# EAGLE schematic handshake (EAGLE 7.6.0)
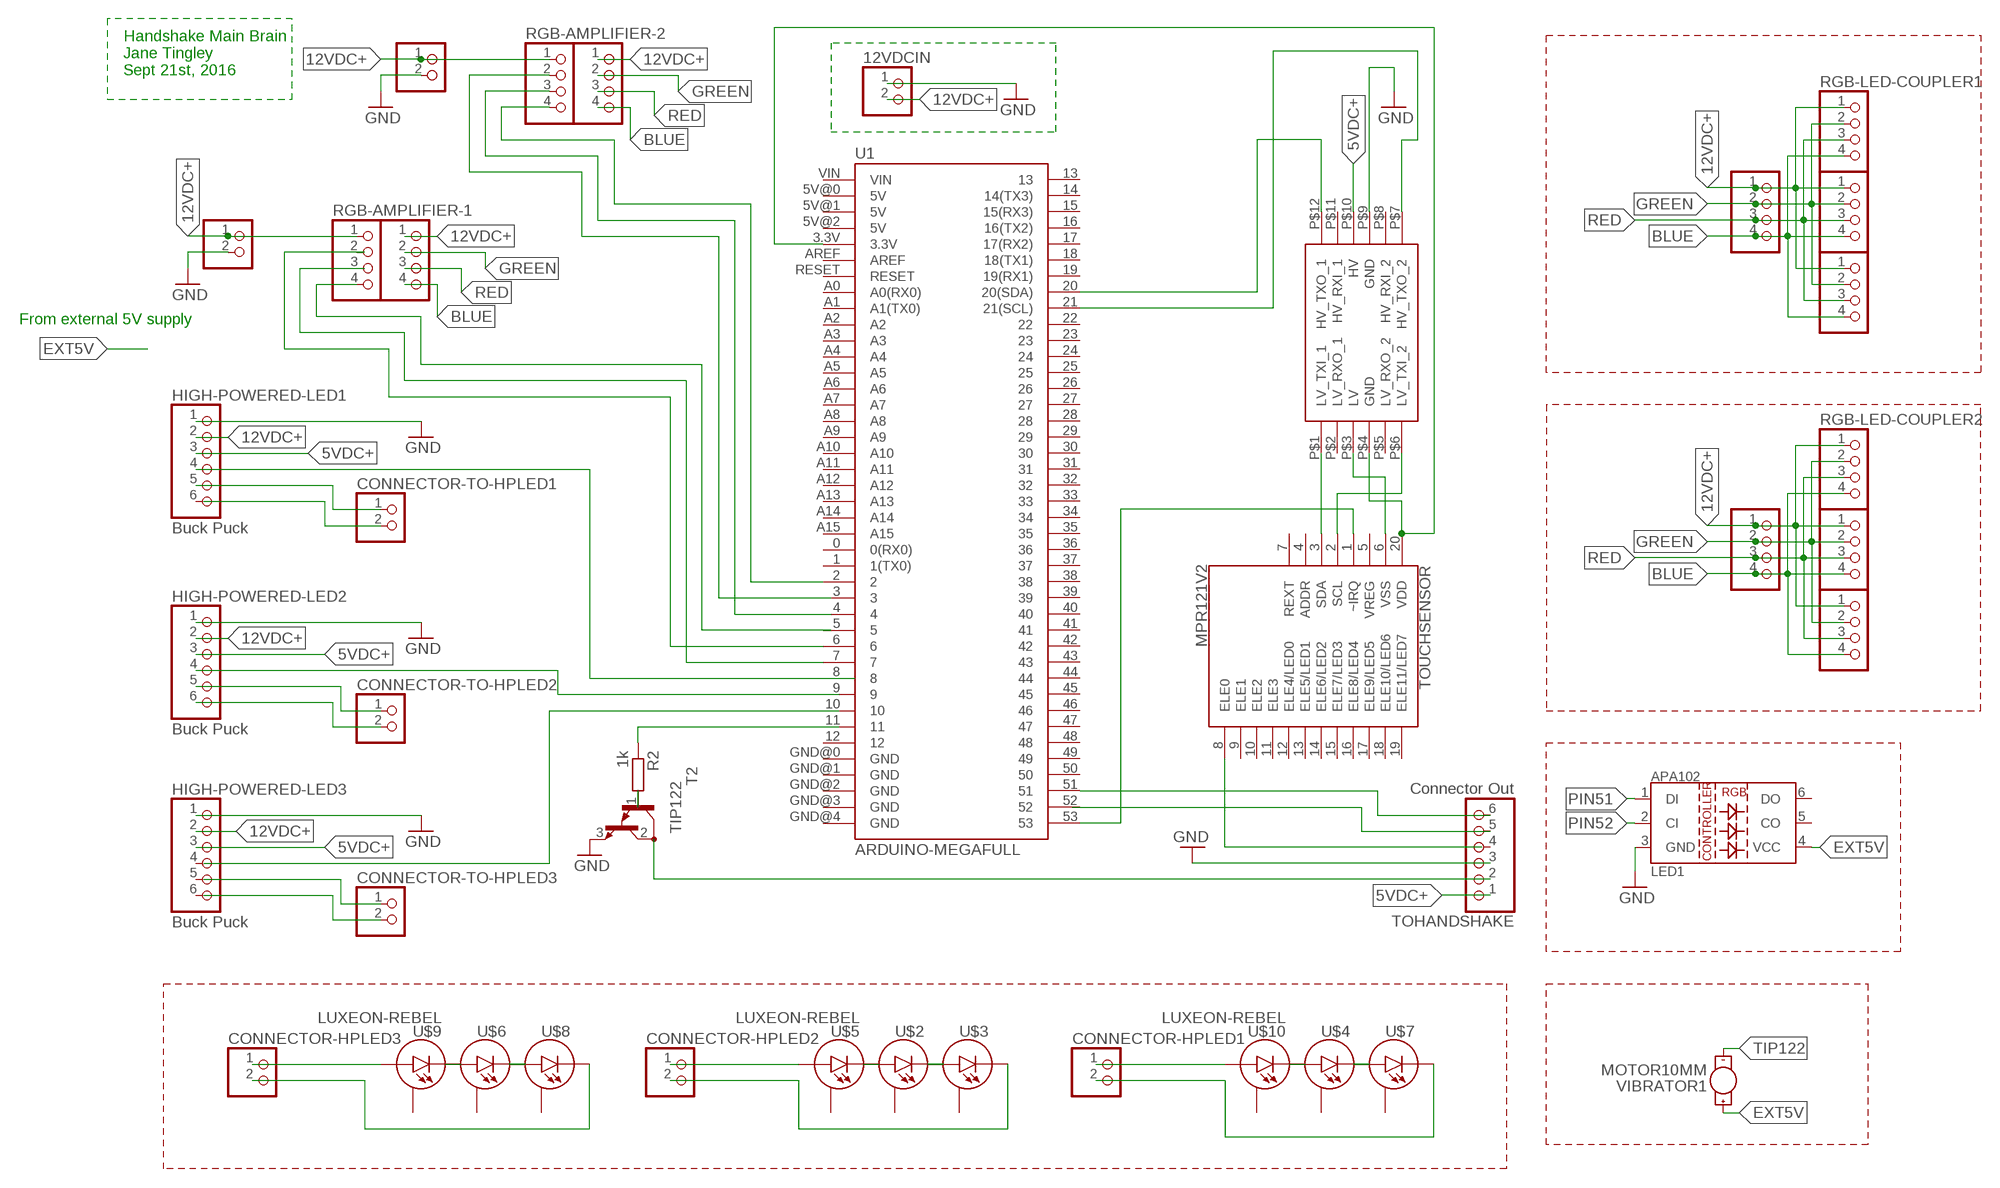
[diagram p0: schematic, sheet 1]

## Parts
12VDCIN  PINHD-1X2  [1X02]
CONNECTOR-HPLED1  PINHD-1X2  [1X02]
CONNECTOR-HPLED2  PINHD-1X2  [1X02]
CONNECTOR-HPLED3  PINHD-1X2  [1X02]
CONNECTOR-TO-HPLED1  PINHD-1X2  [1X02]
CONNECTOR-TO-HPLED2  PINHD-1X2  [1X02]
CONNECTOR-TO-HPLED3  PINHD-1X2  [1X02]
HIGH-POWERED-LED1  Buck Puck  PINHD-1X6  [1X06]
HIGH-POWERED-LED2  Buck Puck  PINHD-1X6  [1X06]
HIGH-POWERED-LED3  Buck Puck  PINHD-1X6  [1X06]
JP1  PINHD-1X4  [1X04]
JP2  PINHD-1X4  [1X04]
JP3  PINHD-1X4  [1X04]
JP4  PINHD-1X4  [1X04]
JP6  PINHD-1X2  [1X02]
JP7  PINHD-1X2  [1X02]
JP8  PINHD-1X4  [1X04]
JP9  PINHD-1X4  [1X04]
JP10  PINHD-1X4  [1X04]
JP11  PINHD-1X4  [1X04]
LED1  LED-APA102  [LED-APA102]
R2  1k  R-EU_0204/5  [0204/5]
RGB-AMPLIFIER-1  PINHD-1X4  [1X04]
RGB-AMPLIFIER-2  PINHD-1X4  [1X04]
RGB-LED-COUPLER1  PINHD-1X4  [1X04]
RGB-LED-COUPLER2  PINHD-1X4  [1X04]
T2  TIP122  [TO220]
TOHANDSHAKE  Connector Out  PINHD-1X6  [1X06]
TOUCHSENSOR  MPR121V2  [QFN-20-0.4MM-V2]
U1  ARDUINO-MEGAFULL  [ARDUINO_MEGA]
U$2  LUXEON-REBEL  [LUXEON-REBEL]
U$3  LUXEON-REBEL  [LUXEON-REBEL]
U$4  LUXEON-REBEL  [LUXEON-REBEL]
U$5  LUXEON-REBEL  [LUXEON-REBEL]
U$6  LUXEON-REBEL  [LUXEON-REBEL]
U$7  LUXEON-REBEL  [LUXEON-REBEL]
U$8  LUXEON-REBEL  [LUXEON-REBEL]
U$9  LUXEON-REBEL  [LUXEON-REBEL]
U$10  LUXEON-REBEL  [LUXEON-REBEL]
U$11  LOGIC_LEVEL_CONVERTER  [LOGIC_LEVEL_CONVERTER]
VIBRATOR1  MOTOR10MM  [VIBE-MOTOR-10MM]

## Nets
5VDC+: HIGH-POWERED-LED1.3 HIGH-POWERED-LED2.3 HIGH-POWERED-LED3.3 TOHANDSHAKE.1 TOHANDSHAKE.3 U$11.P$10(HV) ; supply symbol labelled GND
12VDC+: 12VDCIN.2 HIGH-POWERED-LED1.2 HIGH-POWERED-LED2.2 HIGH-POWERED-LED3.2 JP1.1 JP2.1 JP3.1 JP4.1 JP6.1 JP7.1 JP8.1 JP9.1 JP10.1 JP11.1 RGB-AMPLIFIER-1.1 RGB-AMPLIFIER-2.1 RGB-LED-COUPLER1.1 RGB-LED-COUPLER2.1
BLUE: JP1.4 JP2.4 JP3.4 JP4.4 JP8.4 JP9.4 JP10.4 JP11.4 RGB-LED-COUPLER1.4 RGB-LED-COUPLER2.4
EXT5V: LED1.4(VCC) VIBRATOR1.+
GND: 12VDCIN.1 HIGH-POWERED-LED1.1 HIGH-POWERED-LED2.1 HIGH-POWERED-LED3.1 JP6.2 JP7.2 LED1.3(GND) T2.3(E) U$11.P$9(GND)
GREEN: JP1.2 JP2.2 JP3.2 JP4.2 JP8.2 JP9.2 JP10.2 JP11.2 RGB-LED-COUPLER1.2 RGB-LED-COUPLER2.2
N$1: HIGH-POWERED-LED1.4
N$2: U$4.ANODE(A) U$10.CATHODE(C)
N$3: U$4.CATHODE(C) U$7.ANODE(A)
N$4: CONNECTOR-HPLED1.1 U$10.ANODE(A)
N$5: CONNECTOR-HPLED1.2 U$7.CATHODE(C)
N$6: U$2.ANODE(A) U$5.CATHODE(C)
N$7: U$2.CATHODE(C) U$3.ANODE(A)
N$8: HIGH-POWERED-LED2.4
N$9: CONNECTOR-HPLED2.1 U$5.ANODE(A)
N$10: CONNECTOR-HPLED2.2 U$3.CATHODE(C)
N$11: U$6.ANODE(A) U$9.CATHODE(C)
N$12: U$6.CATHODE(C) U$8.ANODE(A)
N$14: CONNECTOR-TO-HPLED3.1
N$15: CONNECTOR-HPLED3.2 U$8.CATHODE(C)
N$16: R2.1
N$17: TOUCHSENSOR.1(~IRQ) U1.53
N$18: R2.2 T2.1(B)
N$20: TOHANDSHAKE.6 U1.51
N$21: TOHANDSHAKE.5
N$22: TOUCHSENSOR.8(ELE0)
N$23: TOUCHSENSOR.20(VDD) U1.3.3V U$11.P$3(LV)
N$24: TOUCHSENSOR.6(VSS) U$11.P$4(GND)
N$25: CONNECTOR-TO-HPLED3.2
N$26: TOUCHSENSOR.3(SDA) U$11.P$1(LV_TXI_1)
N$27: TOUCHSENSOR.2(SCL) U$11.P$6(LV_TXI_2)
N$28: U1.20(20(SDA)) U$11.P$12(HV_TXO_1)
N$29: U1.21(21(SCL)) U$11.P$7(HV_TXO_2)
N$30: CONNECTOR-HPLED3.1 U$9.ANODE(A)
N$31: CONNECTOR-TO-HPLED1.1 HIGH-POWERED-LED1.5
N$32: CONNECTOR-TO-HPLED2.1 HIGH-POWERED-LED2.5
N$33: CONNECTOR-TO-HPLED2.2 HIGH-POWERED-LED2.6
N$34: CONNECTOR-TO-HPLED1.2
N$35: RGB-AMPLIFIER-2.3
N$36: RGB-AMPLIFIER-2.2
N$37: RGB-AMPLIFIER-1.4
N$38: U1.7
N$39: U1.6
PIN2: RGB-AMPLIFIER-2.4 U1.2
PIN51: LED1.1(DI)
PIN52: LED1.2(CI)
RED: JP1.3 JP2.3 JP3.3 JP4.3 JP8.3 JP9.3 JP10.3 JP11.3 RGB-LED-COUPLER1.3 RGB-LED-COUPLER2.3
TIP122: T2.2(C) TOHANDSHAKE.2 VIBRATOR1.-
Unconnected: HIGH-POWERED-LED1.6 HIGH-POWERED-LED3.4 HIGH-POWERED-LED3.5 HIGH-POWERED-LED3.6 LED1.5(CO) LED1.6(DO) RGB-AMPLIFIER-1.2 RGB-AMPLIFIER-1.3 TOHANDSHAKE.4 TOUCHSENSOR.4(ADDR) TOUCHSENSOR.5(VREG) TOUCHSENSOR.7(REXT) TOUCHSENSOR.9(ELE1) TOUCHSENSOR.10(ELE2) TOUCHSENSOR.11(ELE3) TOUCHSENSOR.12(ELE4/LED0) TOUCHSENSOR.13(ELE5/LED1) TOUCHSENSOR.14(ELE6/LED2) TOUCHSENSOR.15(ELE7/LED3) TOUCHSENSOR.16(ELE8/LED4) TOUCHSENSOR.17(ELE9/LED5) TOUCHSENSOR.18(ELE10/LED6) TOUCHSENSOR.19(ELE11/LED7) U1.0(0(RX0)) U1.1(1(TX0)) U1.3 U1.4 U1.5 U1.5V@0(5V) U1.5V@1(5V) U1.5V@2(5V) U1.8 U1.9 U1.10 U1.11 U1.12 U1.13 U1.14(14(TX3)) U1.15(15(RX3)) U1.16(16(TX2)) U1.17(17(RX2)) U1.18(18(TX1)) U1.19(19(RX1)) U1.22 U1.23 U1.24 U1.25 U1.26 U1.27 U1.28 U1.29 U1.30 U1.31 U1.32 U1.33 U1.34 U1.35 U1.36 U1.37 U1.38 U1.39 U1.40 U1.41 U1.42 U1.43 U1.44 U1.45 U1.46 U1.47 U1.48 U1.49 U1.50 U1.52 U1.A0(A0(RX0)) U1.A1(A1(TX0)) U1.A2 U1.A3 U1.A4 U1.A5 U1.A6 U1.A7 U1.A8 U1.A9 U1.A10 U1.A11 U1.A12 U1.A13 U1.A14 U1.A15 U1.AREF U1.GND@0(GND) U1.GND@1(GND) U1.GND@2(GND) U1.GND@3(GND) U1.GND@4(GND) U1.RESET U1.VIN U$2.P$3(S) U$3.P$3(S) U$4.P$3(S) U$5.P$3(S) U$6.P$3(S) U$7.P$3(S) U$8.P$3(S) U$9.P$3(S) U$10.P$3(S) U$11.P$2(LV_RXO_1) U$11.P$5(LV_RXO_2) U$11.P$8(HV_RXI_2) U$11.P$11(HV_RXI_1)

## Notes on the sheet
- Handshake Main Brain
  Jane Tingley
  Sept 21st, 2016
- From external 5V supply

## Library data of the parts
12VDCIN CONNECTOR-HPLED1-CONNECTOR-HPLED3 CONNECTOR-TO-HPLED1-CONNECTOR-TO-HPLED3 JP6 JP7 = pinhead:PINHD-1X2: PIN HEADER
HIGH-POWERED-LED1-HIGH-POWERED-LED3 TOHANDSHAKE = pinhead:PINHD-1X6: PIN HEADER
JP1-JP4 JP8-JP11 RGB-AMPLIFIER-1 RGB-AMPLIFIER-2 RGB-LED-COUPLER1 RGB-LED-COUPLER2 = pinhead:PINHD-1X4: PIN HEADER
LED1 = Ai_LED:LED-APA102
R2 = rcl:R-EU_: RESISTOR, European symbol
T2 = transistor:TIP122: NPN BIPOLAR DARLINGTON TRANSISTOR
TOUCHSENSOR = SparkFun-Sensors:MPR121: MPR121 Capacitive Touch Sensor Controller. Variant "V2" was created using an image import of the bottom of the IC. It matches metal to metal.
U1 = SparkFun-Boards:ARDUINO-MEGA: Arduino Mega board footprint
U$2-U$10 = SparkFun-LED:LUXEON-REBEL: Luxeon Rebel single-color high output LED
U$11 = SparkFun-Boards:LOGIC_LEVEL_CONVERTER: Logic Level Converter (3.3v - 5v) https://www.sparkfun.com/products/8745
VIBRATOR1 = SparkFun-Electromechanical:MOTOR: Vibration Motor- ROB-08449 Physical dimension and wire connections for this powerful vibration motor. Motor has a self adhesive backing.